# Altium schematic sheet FPGA核心板04.SchDoc
size A4
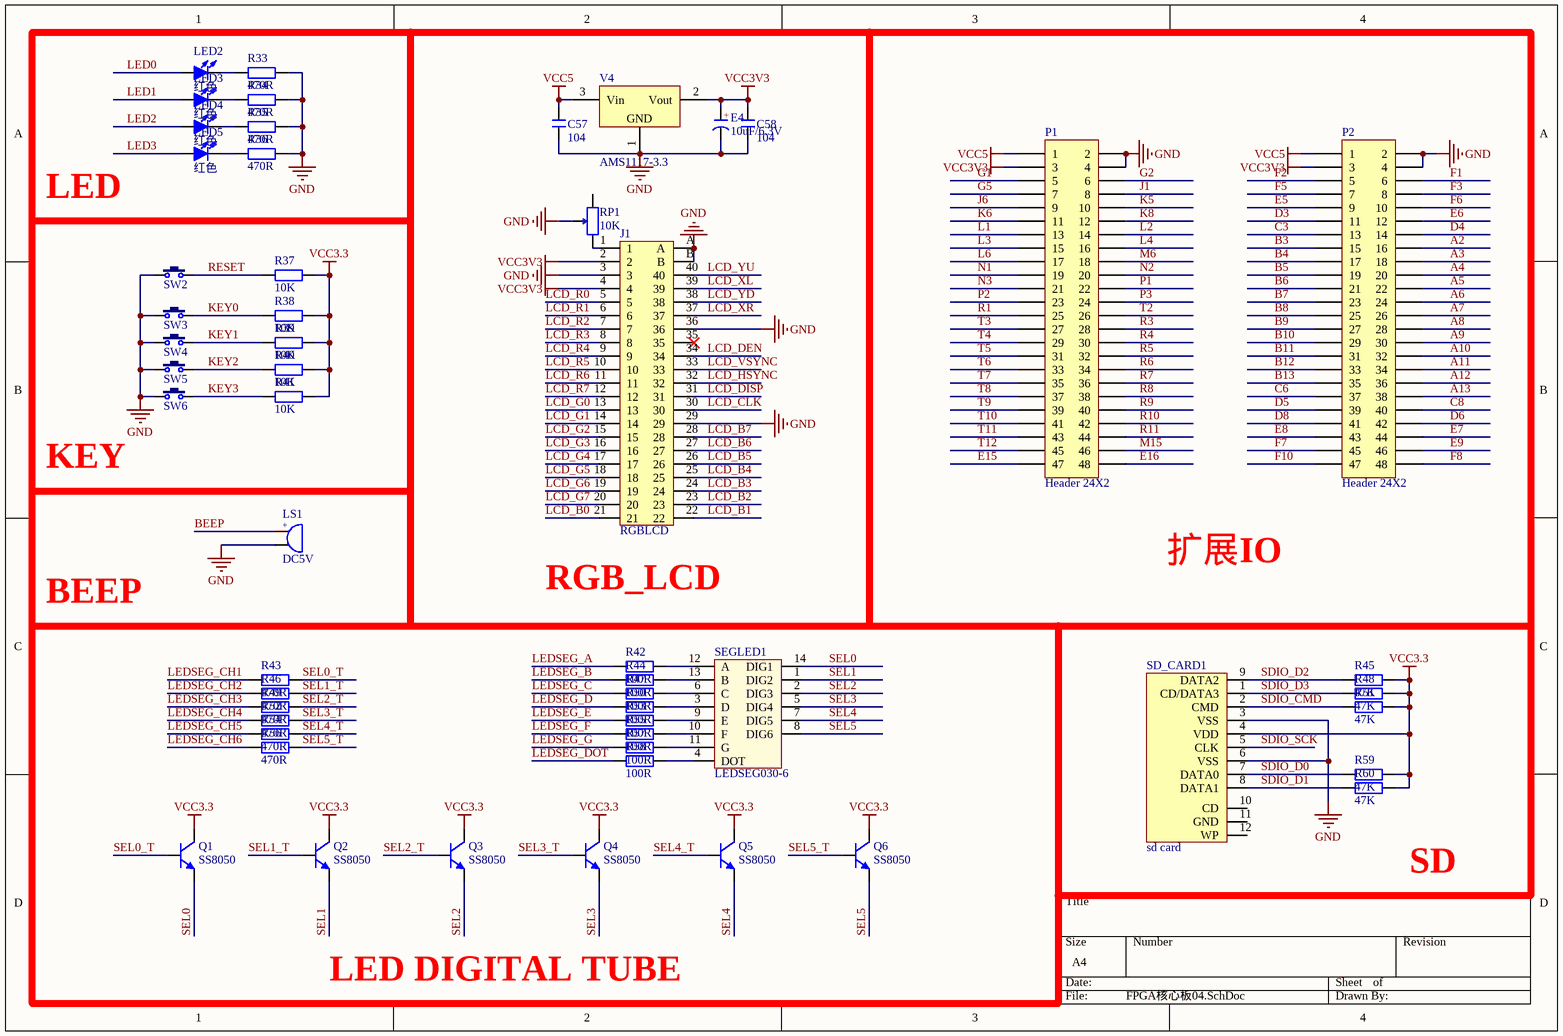
[diagram p0: FPGA核心板04.SchDoc]

## Parts
C57  104  [C 0603_L]
C58  104  [C 0603_L]
E4  10uF/6.3V  [CD A(3216)]
J1  RGBLCD  [FPC-TOP40]
LED2  红色  [LED 0603B]
LED3  红色  [LED 0603B]
LED4  红色  [LED 0603B]
LED5  红色  [LED 0603B]
LS1  DC5V  [BEEP 5x9x5.5]
P1  Header 24X2  [HDR2X24]
P2  Header 24X2  [HDR2X24]
Q1  SS8050  [SOT23-3L]
Q2  SS8050  [SOT23-3L]
Q3  SS8050  [SOT23-3L]
Q4  SS8050  [SOT23-3L]
Q5  SS8050  [SOT23-3L]
Q6  SS8050  [SOT23-3L]
R33  470R  [R 0603_L]
R34  470R  [R 0603_L]
R35  470R  [R 0603_L]
R36  470R  [R 0603_L]
R37  10K  [R 0603_L]
R38  10K  [R 0603_L]
R39  10K  [R 0603_L]
R40  10K  [R 0603_L]
R41  10K  [R 0603_L]
R42  100R  [R 0603_L]
R43  470R  [R 0603_L]
R44  100R  [R 0603_L]
R45  47K  [R 0603_L]
R46  470R  [R 0603_L]
R47  100R  [R 0603_L]
R48  47K  [R 0603_L]
R49  470R  [R 0603_L]
R50  100R  [R 0603_L]
R51  47K  [R 0603_L]
R52  470R  [R 0603_L]
R53  100R  [R 0603_L]
R54  470R  [R 0603_L]
R55  100R  [R 0603_L]
R56  470R  [R 0603_L]
R57  100R  [R 0603_L]
R58  100R  [R 0603_L]
R59  47K  [R 0603_L]
R60  47K  [R 0603_L]
RP1  10K  [RM065]
SD_CARD1  sd card  [SD CARD 全高]
SEGLED1  LEDSEG030-6  [leddisplay-0.3]
SW2  3x6x5  [TSW SMD-3*6*2.5]  (value not drawn)
SW3  3x6x5  [TSW SMD-3*6*2.5]  (value not drawn)
SW4  3x6x5  [TSW SMD-3*6*2.5]  (value not drawn)
SW5  3x6x5  [TSW SMD-3*6*2.5]  (value not drawn)
SW6  3x6x5  [TSW SMD-3*6*2.5]  (value not drawn)
V4  AMS1117-3.3  [SOT223_L]

## Nets
GND: C57.2 C58.2 E4.2(K) J1.3 J1.29 J1.36 J1.A J1.B LS1.2 P1.2 P1.4 P2.2 P2.4 R33.1 R34.1 R35.1 R36.1 RP1.2 SD_CARD1.3(VSS) SD_CARD1.6(VSS) SW2.1 SW3.1 SW4.1 SW5.1 SW6.1 V4.1(GND)
VCC3.3: Q1.3(C) Q2.3(C) Q3.3(C) Q4.3(C) Q5.3(C) Q6.3(C) R37.1 R38.1 R39.1 R40.1 R41.1 R45.1 R48.1 R51.1 R59.1 R60.1 SD_CARD1.4(VDD)
VCC3V3: C58.1 E4.1(A) J1.2 J1.4 P1.3 P2.3 V4.2(Vout)
VCC5: C57.1 P1.1 P2.1 V4.3(Vin)
A2: P2.16
A3: P2.18
A4: P2.20
A5: P2.22
A6: P2.24
A7: P2.26
A8: P2.28
A9: P2.30
A10: P2.32
A11: P2.34
A12: P2.36
A13: P2.38
B3: P2.15
B4: P2.17
B5: P2.19
B6: P2.21
B7: P2.23
B8: P2.25
B9: P2.27
B10: P2.29
B11: P2.31
B12: P2.33
B13: P2.35
BEEP: LS1.1
C3: P2.13
C6: P2.37
C8: P2.40
D3: P2.11
D4: P2.14
D5: P2.39
D6: P2.42
D8: P2.41
E5: P2.9
E6: P2.12
E7: P2.44
E8: P2.43
E9: P2.46
E15: P1.47
E16: P1.48
F1: P2.6
F2: P2.5
F3: P2.8
F5: P2.7
F6: P2.10
F7: P2.45
F8: P2.48
F10: P2.47
G1: P1.5
G2: P1.6
G5: P1.7
J1: P1.8
J6: P1.9
K5: P1.10
K6: P1.11
K8: P1.12
KEY0: R38.2 SW3.2
KEY1: R39.2 SW4.2
KEY2: R40.2 SW5.2
KEY3: R41.2 SW6.2
L1: P1.13
L2: P1.14
L3: P1.15
L4: P1.16
L6: P1.17
LCD_B0: J1.21
LCD_B1: J1.22
LCD_B2: J1.23
LCD_B3: J1.24
LCD_B4: J1.25
LCD_B5: J1.26
LCD_B6: J1.27
LCD_B7: J1.28
LCD_CLK: J1.30
LCD_DEN: J1.34
LCD_DISP: J1.31
LCD_G0: J1.13
LCD_G1: J1.14
LCD_G2: J1.15
LCD_G3: J1.16
LCD_G4: J1.17
LCD_G5: J1.18
LCD_G6: J1.19
LCD_G7: J1.20
LCD_HSYNC: J1.32
LCD_R0: J1.5
LCD_R1: J1.6
LCD_R2: J1.7
LCD_R3: J1.8
LCD_R4: J1.9
LCD_R5: J1.10
LCD_R6: J1.11
LCD_R7: J1.12
LCD_VSYNC: J1.33
LCD_XL: J1.39
LCD_XR: J1.37
LCD_YD: J1.38
LCD_YU: J1.40
LED0: LED2.1(A)
LED1: LED3.1(A)
LED2: LED4.1(A)
LED3: LED5.1(A)
LEDSEG_A: R42.2
LEDSEG_B: R44.2
LEDSEG_C: R47.2
LEDSEG_CH1: R43.2
LEDSEG_CH2: R46.2
LEDSEG_CH3: R49.2
LEDSEG_CH4: R52.2
LEDSEG_CH5: R54.2
LEDSEG_CH6: R56.2
LEDSEG_D: R50.2
LEDSEG_DOT: R58.2
LEDSEG_E: R53.2
LEDSEG_F: R55.2
LEDSEG_G: R57.2
M6: P1.18
M15: P1.46
N1: P1.19
N2: P1.20
N3: P1.21
P1: P1.22
P2: P1.23
P3: P1.24
R1: P1.25
R3: P1.28
R4: P1.30
R5: P1.32
R6: P1.34
R7: P1.36
R8: P1.38
R9: P1.40
R10: P1.42
R11: P1.44
RESET: R37.2 SW2.2
SDIO_CMD: R51.2 SD_CARD1.2(CMD)
SDIO_D0: R59.2 SD_CARD1.7(DATA0)
SDIO_D1: R60.2 SD_CARD1.8(DATA1)
SDIO_D2: R45.2 SD_CARD1.9(DATA2)
SDIO_D3: R48.2 SD_CARD1.1(CD/DATA3)
SDIO_SCK: SD_CARD1.5(CLK)
SEL0: Q1.2(E) SEGLED1.14(DIG1)
SEL0_T: Q1.1(B) R43.1
SEL1: Q2.2(E) SEGLED1.1(DIG2)
SEL1_T: Q2.1(B) R46.1
SEL2: Q3.2(E) SEGLED1.2(DIG3)
SEL2_T: Q3.1(B) R49.1
SEL3: Q4.2(E) SEGLED1.5(DIG4)
SEL3_T: Q4.1(B) R52.1
SEL4: Q5.2(E) SEGLED1.7(DIG5)
SEL4_T: Q5.1(B) R54.1
SEL5: Q6.2(E) SEGLED1.8(DIG6)
SEL5_T: Q6.1(B) R56.1
T2: P1.26
T3: P1.27
T4: P1.29
T5: P1.31
T6: P1.33
T7: P1.35
T8: P1.37
T9: P1.39
T10: P1.41
T11: P1.43
T12: P1.45
NetJ1_1: J1.1 RP1.1
NetLED2_2: LED2.2(K) R33.2
NetLED3_2: LED3.2(K) R34.2
NetLED4_2: LED4.2(K) R35.2
NetLED5_2: LED5.2(K) R36.2
NetR42_1: R42.1 SEGLED1.12(A)
NetR44_1: R44.1 SEGLED1.13(B)
NetR47_1: R47.1 SEGLED1.6(C)
NetR50_1: R50.1 SEGLED1.3(D)
NetR53_1: R53.1 SEGLED1.9(E)
NetR55_1: R55.1 SEGLED1.10(F)
NetR57_1: R57.1 SEGLED1.11(G)
NetR58_1: R58.1 SEGLED1.4(DOT)

Not connected (* = marked no-connect by the designer): J1 35*; RP1 3; SD_CARD1 10(CD) 11(GND) 12(WP)

## Notes on the sheet
- LED
- KEY
- 扩展IO
- BEEP
- (near J1) RGB_LCD
- SD
- LED DIGITAL TUBE
- (in symbol BEEP) +
- (in symbol CT) +

## Library data of the parts
C57 C58 = C: 贴片电容; BOM名称: 无极性贴片电容; 淘宝ID: 封装库来自淘宝 ID：黄晶宝石; 联系售后: https://shop463601444.taobao.com
E4 = CT: 贴片钽电容; 淘宝ID: 封装库来自淘宝 ID：黄晶宝石; BOM名称: 贴片钽电容; 联系售后: https://shop463601444.taobao.com
J1 = FPC-40: FPC-40P-0.5mm
LED2-LED5 = LED-SMD: 贴片LED; 版权归属: 封装库来自淘宝 ID：黄晶宝石; BOM名称: 贴片LED; 学习资源: https://shop463601444.taobao.com
LS1 = BEEP: 蜂鸣器; 版权归属: 封装库来自淘宝 ID：黄晶宝石; BOM名称: 蜂鸣器; 联系售后: https://shop463601444.taobao.com
P1 P2 = Header 24X2: Header, 24-Pin, Dual row; LatestRevisionDate: 17-Jul-2002; LatestRevisionNote: Re-released for DXP Platform.; Publisher: Altium Limited
Q1-Q6 = 8050-SMD: 高频放大-NPN型; 版权归属: 封装库来自淘宝 ID：黄晶宝石; 属性: 40V 1.5A 1W 100MHZ; BOM名称: 高频放大-NPN型; 联系售后: https://shop463601444.taobao.com
R33-R60 = R: 贴片电阻; 版权归属: 来自淘宝 ID：黄晶宝石; BOM名称: 贴片电阻; 联系售后: https://shop463601444.taobao.com
RP1 = RP: 单联电位器; BOM名称: 插件电位器; 版权归属: 封装库来自淘宝 ID：黄晶宝石; 联系售后: https://shop463601444.taobao.com
SEGLED1 = LEDSEG030-6: 6位数码管,0.3寸,共阴,41*11*5.8mm
SW2-SW6 = TSW 3x6: 3x6轻触开关; 版权归属: 封装库来自淘宝 ID：黄晶宝石; BOM名称: 3x6轻触开关; 学习资源: www.ooocke.com
V4 = AMS1117: 三端稳压芯片; BOM名称: 稳压芯片; 淘宝ID: 封装库来自淘宝 ID：黄晶宝石; 欢迎光临淘宝店铺: https://shop463601444.taobao.com